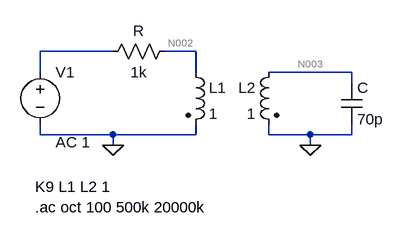
[diagram p0: schematic model_circuit.asc]
model_circuit.asc, the LTspice schematic file:
Version 4
SHEET 1 880 680
WIRE 32 80 -80 80
WIRE 160 80 112 80
WIRE -80 112 -80 80
WIRE 160 112 160 80
WIRE 400 112 272 112
WIRE 400 128 400 112
WIRE -80 208 -80 192
WIRE 32 208 -80 208
WIRE 160 208 160 192
WIRE 160 208 32 208
WIRE 272 208 272 192
WIRE 336 208 272 208
WIRE 400 208 400 192
WIRE 400 208 336 208
WIRE 32 224 32 208
WIRE 336 224 336 208
FLAG 32 224 0
FLAG 336 224 0
SYMBOL voltage -80 96 R0
WINDOW 123 24 124 Left 2
WINDOW 39 0 0 Left 0
SYMATTR Value2 AC 1
SYMATTR InstName V1
SYMATTR Value ""
SYMBOL res 128 64 R90
WINDOW 0 0 56 VBottom 2
WINDOW 3 32 56 VTop 2
SYMATTR InstName R
SYMATTR Value 1k
SYMBOL ind2 144 96 R0
SYMATTR InstName L1
SYMATTR Value 1
SYMATTR Type ind
SYMBOL ind2 288 96 M0
SYMATTR InstName L2
SYMATTR Value 1
SYMATTR Type ind
SYMBOL cap 384 128 R0
SYMATTR InstName C
SYMATTR Value 70p
TEXT -88 288 Left 2 !K9 L1 L2 1
TEXT -88 320 Left 2 !.ac oct 100 500k 20000k

The netlist it stands for:
* model_circuit.asc
V1 N001 0 AC 1
R N002 N001 1k
L1 N002 0 1
L2 N003 0 1
C N003 0 70p
K9 L1 L2 1
.ac oct 100 500k 20000k
.backanno
.end

* Results of the author's LTspice run, read from the files saved beside the schematic
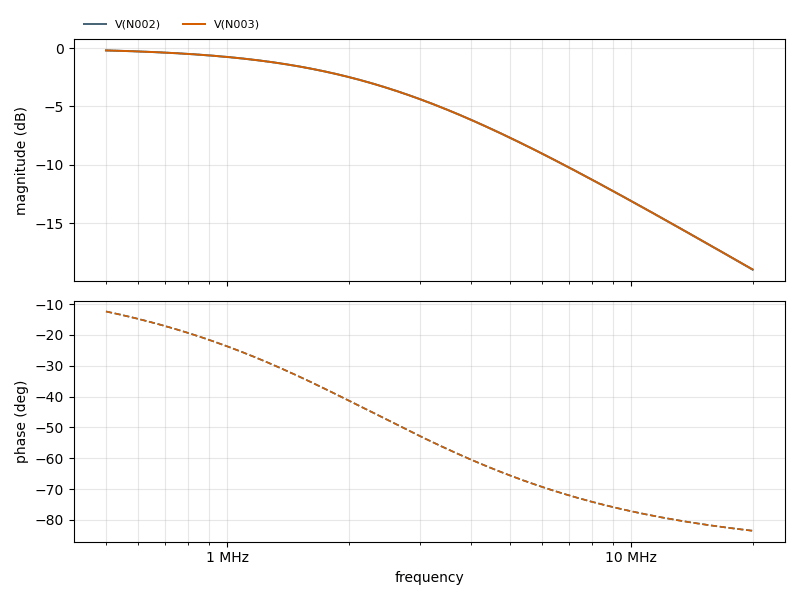
[diagram p1: AC Analysis of model_circuit.asc, plotted from the saved traces]
* AC Analysis, 1 run:
*   V(N002): -0.20 dB at 500 kHz, -18.96 dB at 20 MHz, peak -0.20 dB at 500 kHz, 3 dB below the peak at 2.381 MHz
*   V(N003): -0.20 dB at 500 kHz, -18.94 dB at 20 MHz, peak -0.20 dB at 500 kHz, 3 dB below the peak at 2.381 MHz